# Altium schematic sheet P[12]SOM_Interface.SchDoc
size A3
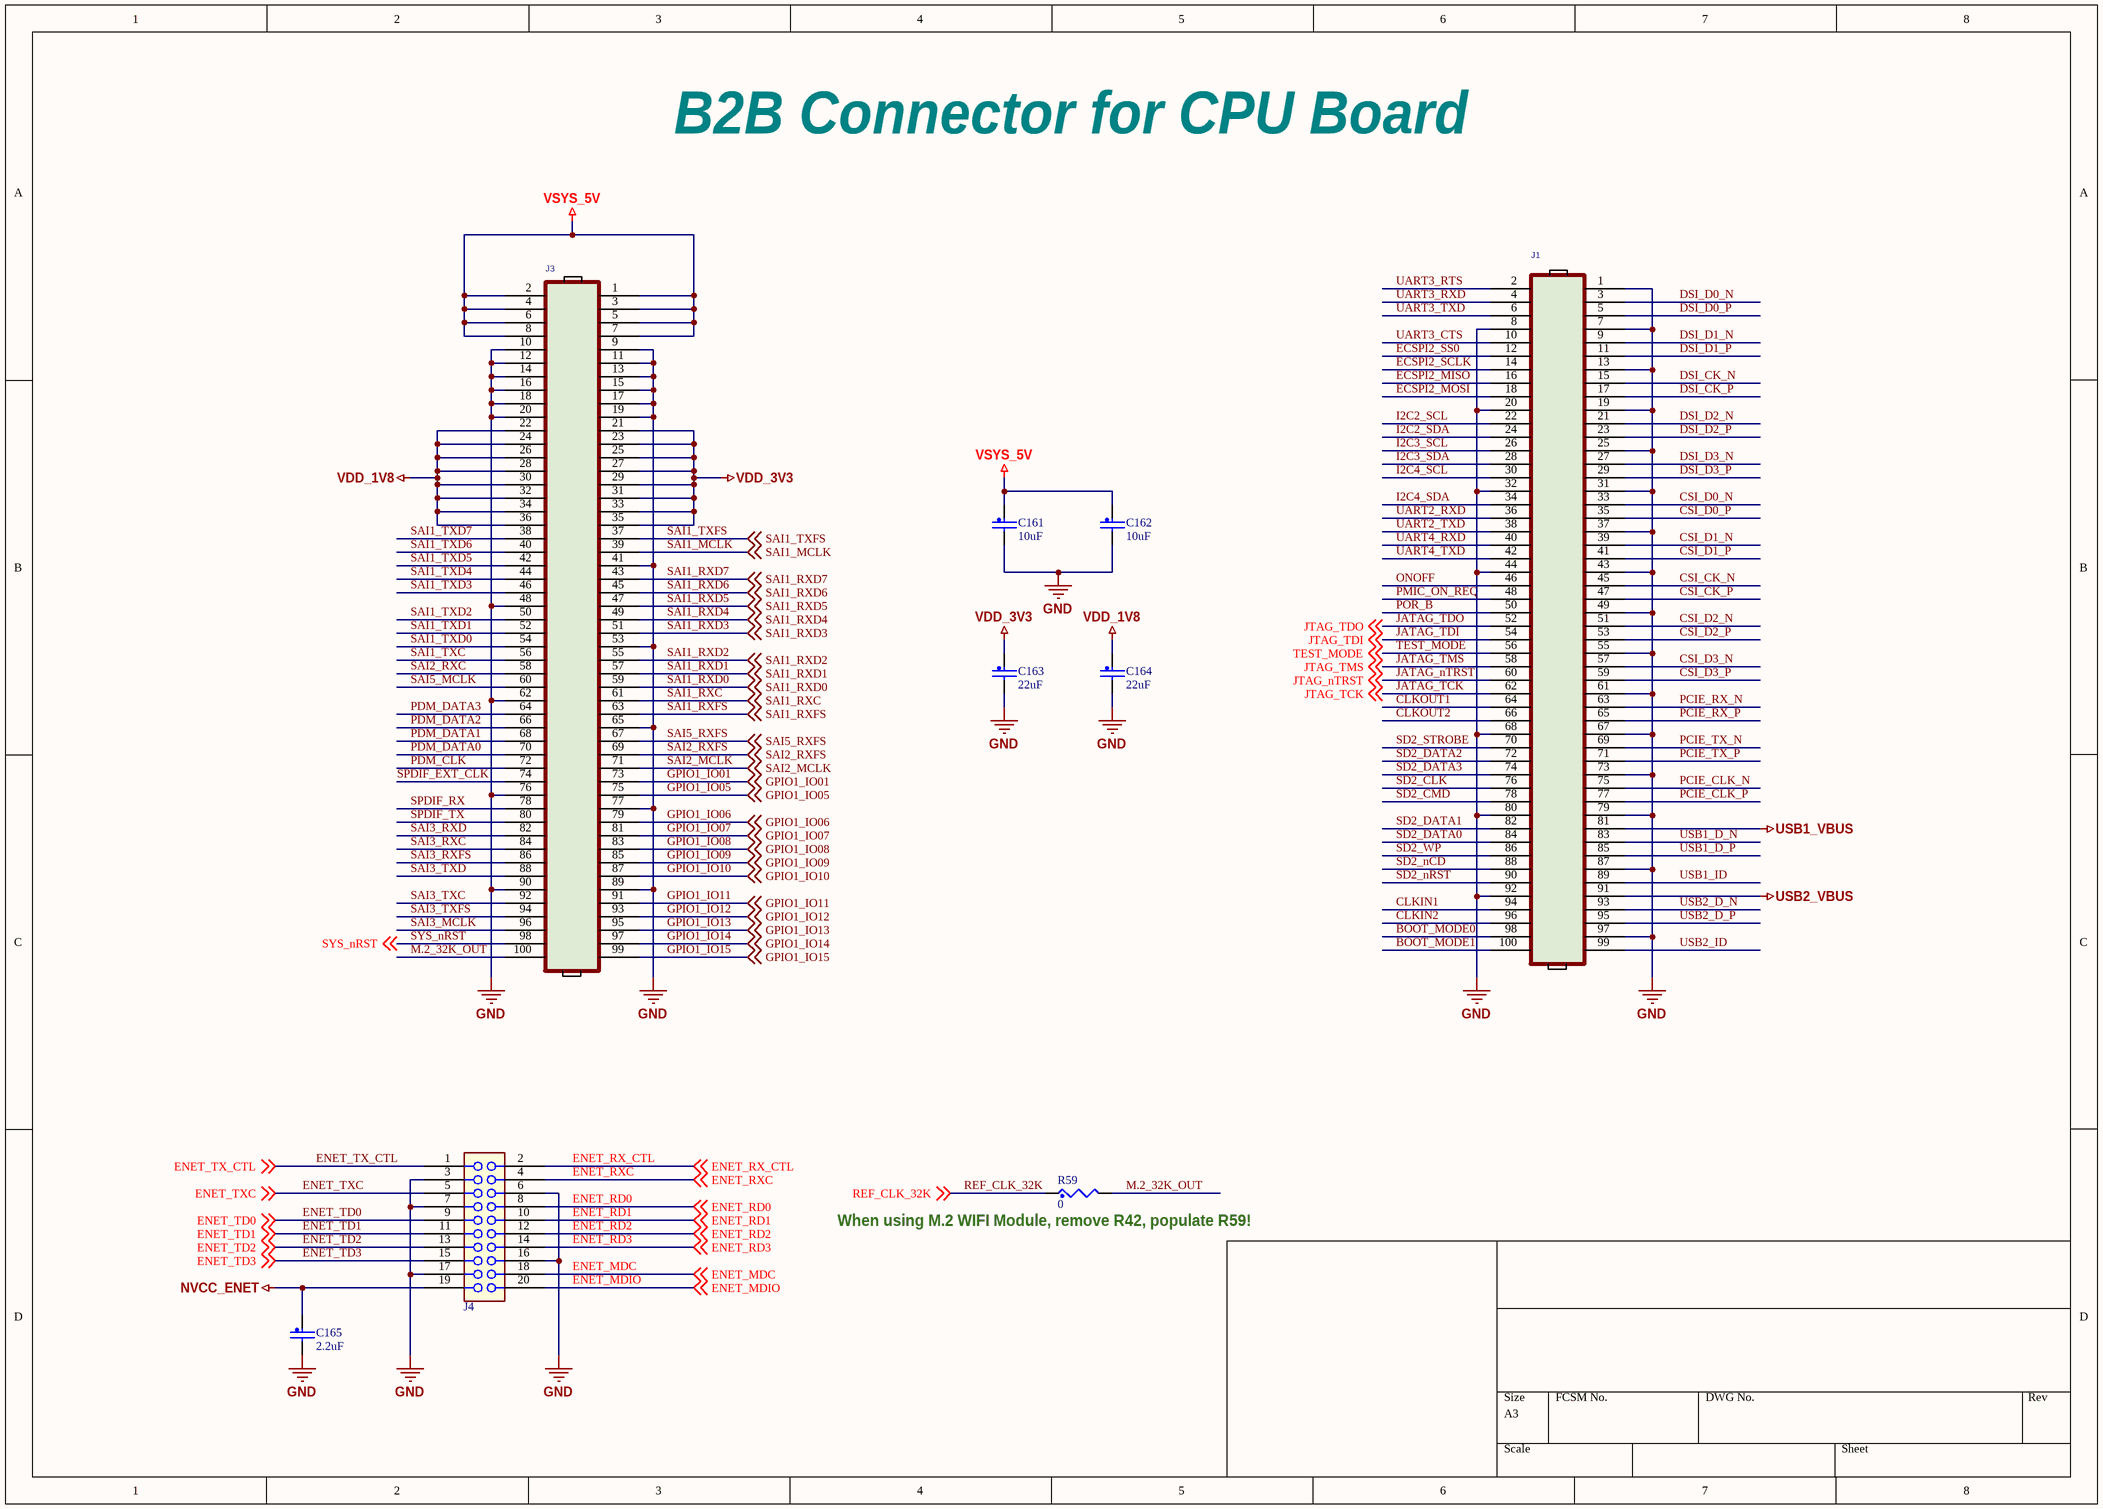
[diagram p0: P[12]SOM_Interface.SchDoc]

## Parts
C161  10uF  [0603_CC]
C162  10uF  [0603_CC]
C163  22uF  [0603_CC]
C164  22uF  [0603_CC]
C165  2.2uF  [0402_CC - C]
J1  CON 2X50 PLUG SHRD SMT 0.4MM SP 51H AU  [CON100_0P4_21P7X2P05_SM]  (value not drawn)
J3  CON 2X50 PLUG SHRD SMT 0.4MM SP 51H AU  [CON100_0P4_22P8X3P1_SM]  (value not drawn)
J4  CONN_HDR_10X2_CON20_0P4_6P8X3P1  [CON20_0P4_6P8X3P1_SM]  (value not drawn)
R59  0  [0402_CC]

## Nets
GND: C161.2 C162.2 C163.2 C164.2 C165.2 J1.1 J1.7 J1.8 J1.13 J1.19 J1.20 J1.25 J1.31 J1.32 J1.37 J1.43 J1.44 J1.49 J1.55 J1.61 J1.67 J1.68 J1.73 J1.79 J1.80 J1.87 J1.92 J1.97 J3.9 J3.10 J3.11 J3.12 J3.13 J3.14 J3.15 J3.16 J3.17 J3.18 J3.19 J3.20 J3.41 J3.48 J3.53 J3.62 J3.65 J3.76 J3.77 J3.89 J3.90 J4.3 J4.6 J4.7 J4.16 J4.17
NVCC_ENET: C165.1 J4.19
USB1_VBUS: J1.81
USB2_VBUS: J1.91
VDD_1V8: C164.1 J3.22 J3.24 J3.26 J3.28 J3.30 J3.32 J3.34 J3.36
VDD_3V3: C163.1 J3.21 J3.23 J3.25 J3.27 J3.29 J3.31 J3.33 J3.35
VSYS_5V: C161.1 C162.1 J3.1 J3.2 J3.3 J3.4 J3.5 J3.6 J3.7 J3.8
BOOT_MODE0: J1.98
BOOT_MODE1: J1.100
CLKIN1: J1.94
CLKIN2: J1.96
CLKOUT1: J1.64
CLKOUT2: J1.66
CSI_CK_N: J1.45
CSI_CK_P: J1.47
CSI_D0_N: J1.33
CSI_D0_P: J1.35
CSI_D1_N: J1.39
CSI_D1_P: J1.41
CSI_D2_N: J1.51
CSI_D2_P: J1.53
CSI_D3_N: J1.57
CSI_D3_P: J1.59
DSI_CK_N: J1.15
DSI_CK_P: J1.17
DSI_D0_N: J1.3
DSI_D0_P: J1.5
DSI_D1_N: J1.9
DSI_D1_P: J1.11
DSI_D2_N: J1.21
DSI_D2_P: J1.23
DSI_D3_N: J1.27
DSI_D3_P: J1.29
ECSPI2_MISO: J1.16
ECSPI2_MOSI: J1.18
ECSPI2_SCLK: J1.14
ECSPI2_SS0: J1.12
ENET_MDC: J4.18 ; off-sheet ENET_MDC
ENET_MDIO: J4.20 ; off-sheet ENET_MDIO
ENET_RD0: J4.8 ; off-sheet ENET_RD0
ENET_RD1: J4.10 ; off-sheet ENET_RD1
ENET_RD2: J4.12 ; off-sheet ENET_RD2
ENET_RD3: J4.14 ; off-sheet ENET_RD3
ENET_RX_CTL: J4.2 ; off-sheet ENET_RX_CTL
ENET_RXC: J4.4 ; off-sheet ENET_RXC
ENET_TD0: J4.9 ; off-sheet ENET_TD0
ENET_TD1: J4.11 ; off-sheet ENET_TD1
ENET_TD2: J4.13 ; off-sheet ENET_TD2
ENET_TD3: J4.15 ; off-sheet ENET_TD3
ENET_TX_CTL: J4.1 ; off-sheet ENET_TX_CTL
ENET_TXC: J4.5 ; off-sheet ENET_TXC
GPIO1_IO01: J3.73 ; off-sheet GPIO1_IO01
GPIO1_IO05: J3.75 ; off-sheet GPIO1_IO05
GPIO1_IO06: J3.79 ; off-sheet GPIO1_IO06
GPIO1_IO07: J3.81 ; off-sheet GPIO1_IO07
GPIO1_IO08: J3.83 ; off-sheet GPIO1_IO08
GPIO1_IO09: J3.85 ; off-sheet GPIO1_IO09
GPIO1_IO10: J3.87 ; off-sheet GPIO1_IO10
GPIO1_IO11: J3.91 ; off-sheet GPIO1_IO11
GPIO1_IO12: J3.93 ; off-sheet GPIO1_IO12
GPIO1_IO13: J3.95 ; off-sheet GPIO1_IO13
GPIO1_IO14: J3.97 ; off-sheet GPIO1_IO14
GPIO1_IO15: J3.99 ; off-sheet GPIO1_IO15
I2C2_SCL: J1.22
I2C2_SDA: J1.24
I2C3_SCL: J1.26
I2C3_SDA: J1.28
I2C4_SCL: J1.30
I2C4_SDA: J1.34
JATAG_nTRST: J1.60 ; off-sheet JTAG_nTRST  [also labelled JTAG_nTRST]
JATAG_TCK: J1.62 ; off-sheet JTAG_TCK  [also labelled JTAG_TCK]
JATAG_TDI: J1.54 ; off-sheet JTAG_TDI  [also labelled JTAG_TDI]
JATAG_TDO: J1.52 ; off-sheet JTAG_TDO  [also labelled JTAG_TDO]
JATAG_TMS: J1.58 ; off-sheet JTAG_TMS  [also labelled JTAG_TMS]
M.2_32K_OUT: J3.100 R59.2
ONOFF: J1.46
PCIE_CLK_N: J1.75
PCIE_CLK_P: J1.77
PCIE_RX_N: J1.63
PCIE_RX_P: J1.65
PCIE_TX_N: J1.69
PCIE_TX_P: J1.71
PDM_CLK: J3.72
PDM_DATA0: J3.70
PDM_DATA1: J3.68
PDM_DATA2: J3.66
PDM_DATA3: J3.64
PMIC_ON_REQ: J1.48
POR_B: J1.50
REF_CLK_32K: R59.1 ; off-sheet REF_CLK_32K
SAI1_MCLK: J3.39 ; off-sheet SAI1_MCLK
SAI1_RXC: J3.61 ; off-sheet SAI1_RXC
SAI1_RXD0: J3.59 ; off-sheet SAI1_RXD0
SAI1_RXD1: J3.57 ; off-sheet SAI1_RXD1
SAI1_RXD2: J3.55 ; off-sheet SAI1_RXD2
SAI1_RXD3: J3.51 ; off-sheet SAI1_RXD3
SAI1_RXD4: J3.49 ; off-sheet SAI1_RXD4
SAI1_RXD5: J3.47 ; off-sheet SAI1_RXD5
SAI1_RXD6: J3.45 ; off-sheet SAI1_RXD6
SAI1_RXD7: J3.43 ; off-sheet SAI1_RXD7
SAI1_RXFS: J3.63 ; off-sheet SAI1_RXFS
SAI1_TXC: J3.56
SAI1_TXD0: J3.54
SAI1_TXD1: J3.52
SAI1_TXD2: J3.50
SAI1_TXD3: J3.46
SAI1_TXD4: J3.44
SAI1_TXD5: J3.42
SAI1_TXD6: J3.40
SAI1_TXD7: J3.38
SAI1_TXFS: J3.37 ; off-sheet SAI1_TXFS
SAI2_MCLK: J3.71 ; off-sheet SAI2_MCLK
SAI2_RXC: J3.58
SAI2_RXFS: J3.69 ; off-sheet SAI2_RXFS
SAI3_MCLK: J3.96
SAI3_RXC: J3.84
SAI3_RXD: J3.82
SAI3_RXFS: J3.86
SAI3_TXC: J3.92
SAI3_TXD: J3.88
SAI3_TXFS: J3.94
SAI5_MCLK: J3.60
SAI5_RXFS: J3.67 ; off-sheet SAI5_RXFS
SD2_CLK: J1.76
SD2_CMD: J1.78
SD2_DATA0: J1.84
SD2_DATA1: J1.82
SD2_DATA2: J1.72
SD2_DATA3: J1.74
SD2_nCD: J1.88
SD2_nRST: J1.90
SD2_STROBE: J1.70
SD2_WP: J1.86
SPDIF_EXT_CLK: J3.74
SPDIF_RX: J3.78
SPDIF_TX: J3.80
SYS_nRST: J3.98 ; off-sheet SYS_nRST
TEST_MODE: J1.56 ; off-sheet TEST_MODE
UART2_RXD: J1.36
UART2_TXD: J1.38
UART3_CTS: J1.10
UART3_RTS: J1.2
UART3_RXD: J1.4
UART3_TXD: J1.6
UART4_RXD: J1.40
UART4_TXD: J1.42
USB1_D_N: J1.83
USB1_D_P: J1.85
USB1_ID: J1.89
USB2_D_N: J1.93
USB2_D_P: J1.95
USB2_ID: J1.99

## Notes on the sheet
- B2B Connector for CPU Board
- (near R59) When using M.2 WIFI Module, remove R42, populate R59!

## Library data of the parts
C161-C165 = CAP_NP: CLASS: DISCRETE
J1 J3 = HDR_2X50_M: CLASS: IO; CAD_APPROVED: Yes; Temp_Range: -35 to 85 &#8451;; MFG_PN01: DF40C-100DP-0.4V(51); MFG_NAME01: Hirose; AGILE_PN: 211-80305; HEIGHT: 1.29MM; ROHS: Yes
J4 = CONN_HDR_10X2: CONN_HDR_10X2_CON20_0P4_6P8X3P1\By Arman Arvand; CLASS: IO
R59 = RES: CLASS: DISCRETE